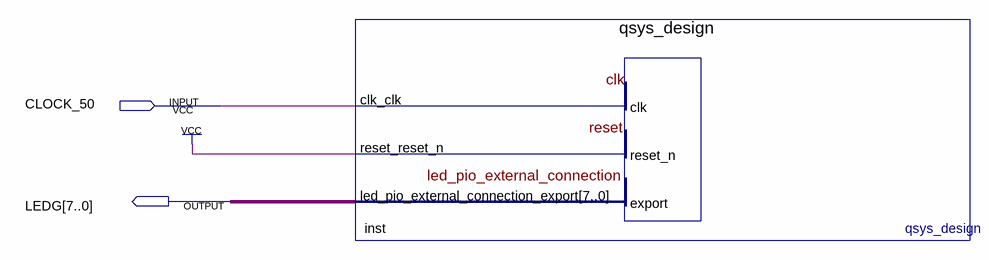
[diagram p0: schematic sheet]
// Quartus schematic cartest.bdf as structural Verilog: 1 symbols, 2 pins
module cartest (
  input  CLOCK_50,
  output [7:0] LEDG
);

  qsys_design inst (.clk_clk(CLOCK_50), .reset_reset_n(1'b1), .led_pio_external_connection_export(LEDG));
endmodule
